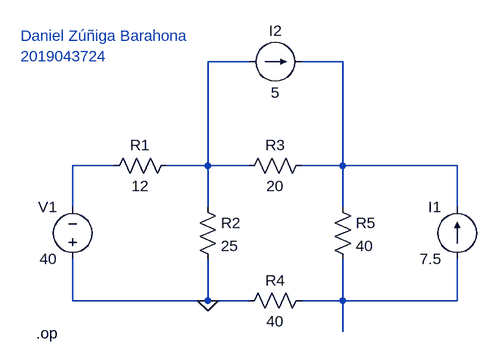
[diagram p0: schematic Ejercicio1.asc]
Ejercicio1.asc, the LTspice schematic file:
Version 4
SHEET 1 880 680
WIRE 384 -112 320 -112
WIRE 528 -112 464 -112
WIRE 176 48 112 48
WIRE 320 48 320 -112
WIRE 320 48 256 48
WIRE 384 48 320 48
WIRE 528 48 528 -112
WIRE 528 48 464 48
WIRE 704 48 528 48
WIRE 112 112 112 48
WIRE 320 112 320 48
WIRE 528 112 528 48
WIRE 704 112 704 48
WIRE 112 256 112 192
WIRE 320 256 320 192
WIRE 320 256 112 256
WIRE 384 256 320 256
WIRE 528 256 528 192
WIRE 528 256 464 256
WIRE 704 256 704 192
WIRE 704 256 528 256
WIRE 528 304 528 256
FLAG 320 256 0
DATAFLAG 528 304 "round((V(n004)*I(R4))*10)/10"
SYMBOL voltage 112 208 R180
WINDOW 0 24 96 Left 2
WINDOW 3 24 16 Left 2
WINDOW 123 0 0 Left 0
WINDOW 39 0 0 Left 0
SYMATTR InstName V1
SYMATTR Value 40
SYMBOL res 272 32 R90
WINDOW 0 0 56 VBottom 2
WINDOW 3 32 56 VTop 2
SYMATTR InstName R1
SYMATTR Value 12
SYMBOL res 304 96 R0
SYMATTR InstName R2
SYMATTR Value 25
SYMBOL res 368 64 R270
WINDOW 0 32 56 VTop 2
WINDOW 3 0 56 VBottom 2
SYMATTR InstName R3
SYMATTR Value 20
SYMBOL res 480 240 R90
WINDOW 0 0 56 VBottom 2
WINDOW 3 32 56 VTop 2
SYMATTR InstName R4
SYMATTR Value 40
SYMBOL res 512 96 R0
SYMATTR InstName R5
SYMATTR Value 40
SYMBOL current 704 192 R180
WINDOW 0 24 80 Left 2
WINDOW 3 24 0 Left 2
WINDOW 123 0 0 Left 0
WINDOW 39 0 0 Left 0
SYMATTR InstName I1
SYMATTR Value 7.5
SYMBOL current 384 -112 R270
WINDOW 0 32 40 VTop 2
WINDOW 3 -32 40 VBottom 2
WINDOW 123 0 0 Left 0
WINDOW 39 0 0 Left 0
SYMATTR InstName I2
SYMATTR Value 5
TEXT 56 306 Left 2 !.op
TEXT 32 -152 Left 2 ;Daniel Zúñiga Barahona\n2019043724

The netlist it stands for:
* Ejercicio1.asc
V1 0 N003 40
R1 N001 N003 12
R2 N001 0 25
R3 N001 N002 20
R4 N004 0 40
R5 N002 N004 40
I1 N004 N002 7.5
I2 N001 N002 5
.op
* Daniel Zúñiga Barahona
* 2019043724
.backanno
.end